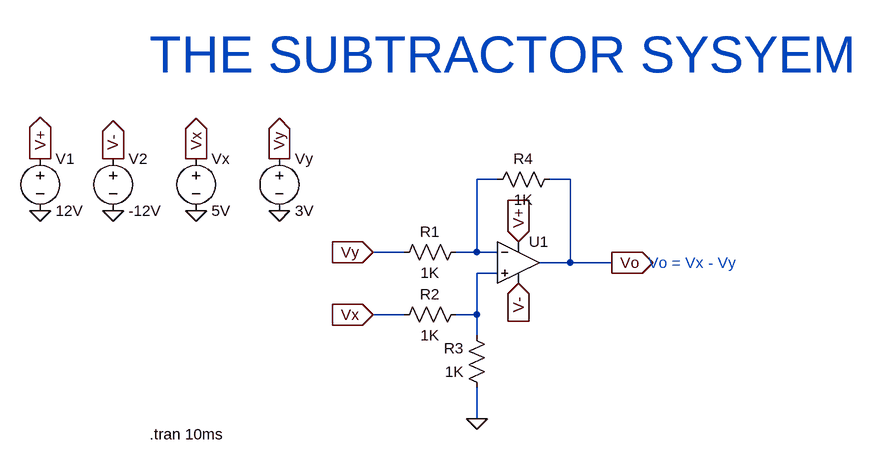
[diagram p0: schematic Subtractor.asc]
Subtractor.asc, the LTspice schematic file:
Version 4
SHEET 1 1012 680
WIRE 176 16 144 16
WIRE 288 16 256 16
WIRE 32 128 -16 128
WIRE 144 128 144 16
WIRE 144 128 112 128
WIRE 176 128 144 128
WIRE 288 144 288 16
WIRE 288 144 240 144
WIRE 352 144 288 144
WIRE 176 160 144 160
WIRE 32 224 -16 224
WIRE 144 224 144 160
WIRE 144 224 112 224
WIRE 144 256 144 224
WIRE 144 384 144 336
FLAG -16 224 Vx
IOPIN -16 224 In
FLAG -16 128 Vy
IOPIN -16 128 In
FLAG 352 144 Vo
IOPIN 352 144 Out
FLAG 144 384 0
FLAG -288 64 0
FLAG -160 64 0
FLAG -160 -16 Vy
IOPIN -160 -16 Out
FLAG -288 -16 Vx
IOPIN -288 -16 Out
FLAG -528 64 0
FLAG -416 64 0
FLAG -528 -16 V+
IOPIN -528 -16 Out
FLAG -416 -16 V-
IOPIN -416 -16 Out
FLAG 208 112 V+
IOPIN 208 112 In
FLAG 208 176 V-
IOPIN 208 176 In
SYMBOL Opamps\\UniversalOpamp2 208 144 R0
SYMATTR InstName U1
SYMBOL res 128 112 R90
WINDOW 0 0 56 VBottom 2
WINDOW 3 32 56 VTop 2
SYMATTR InstName R1
SYMATTR Value 1K
SYMBOL res 128 208 R90
WINDOW 0 0 56 VBottom 2
WINDOW 3 32 56 VTop 2
SYMATTR InstName R2
SYMATTR Value 1K
SYMBOL res 160 352 R180
WINDOW 0 36 76 Left 2
WINDOW 3 36 40 Left 2
SYMATTR InstName R3
SYMATTR Value 1K
SYMBOL res 160 32 R270
WINDOW 0 32 56 VTop 2
WINDOW 3 0 56 VBottom 2
SYMATTR InstName R4
SYMATTR Value 1K
SYMBOL voltage -288 -32 R0
WINDOW 123 0 0 Left 2
WINDOW 39 0 0 Left 2
SYMATTR InstName Vx
SYMATTR Value 5V
SYMBOL voltage -160 -32 R0
SYMATTR InstName Vy
SYMATTR Value 3V
SYMBOL voltage -528 -32 R0
WINDOW 123 0 0 Left 2
WINDOW 39 0 0 Left 2
SYMATTR InstName V1
SYMATTR Value 12V
SYMBOL voltage -416 -32 R0
WINDOW 123 0 0 Left 2
WINDOW 39 0 0 Left 2
SYMATTR InstName V2
SYMATTR Value -12V
TEXT 408 144 Left 2 ;Vo = Vx - Vy
TEXT -360 408 Left 2 !.tran 10ms
TEXT -360 -176 Left 6 ;THE SUBTRACTOR SYSYEM

The netlist it stands for:
* Subtractor.asc
XU1 N002 N001 V+ V- Vo level.2 Avol=1Meg GBW=10Meg Slew=10Meg ilimit=25m rail=0 Vos=0 phimargin=45 en=0 enk=0 in=0 ink=0 Rin=500Meg  ; pins IN+ IN- V+ V- OUT
R1 N001 Vy 1K
R2 N002 Vx 1K
R3 0 N002 1K
R4 N001 Vo 1K
Vx Vx 0 5V
Vy Vy 0 3V
V1 V+ 0 12V
V2 V- 0 -12V
* Vo = Vx - Vy
.tran 10ms
* THE SUBTRACTOR SYSYEM
.lib UniversalOpamps2.sub
.backanno
.end